# Altium schematic sheet Coverpage.SchDoc: =GlobalProjectName
size A3; DrawnBy: Mogens Groth Nicolaisen; DocumentNumber: 1; SheetNumber: 1; SheetTotal: 7
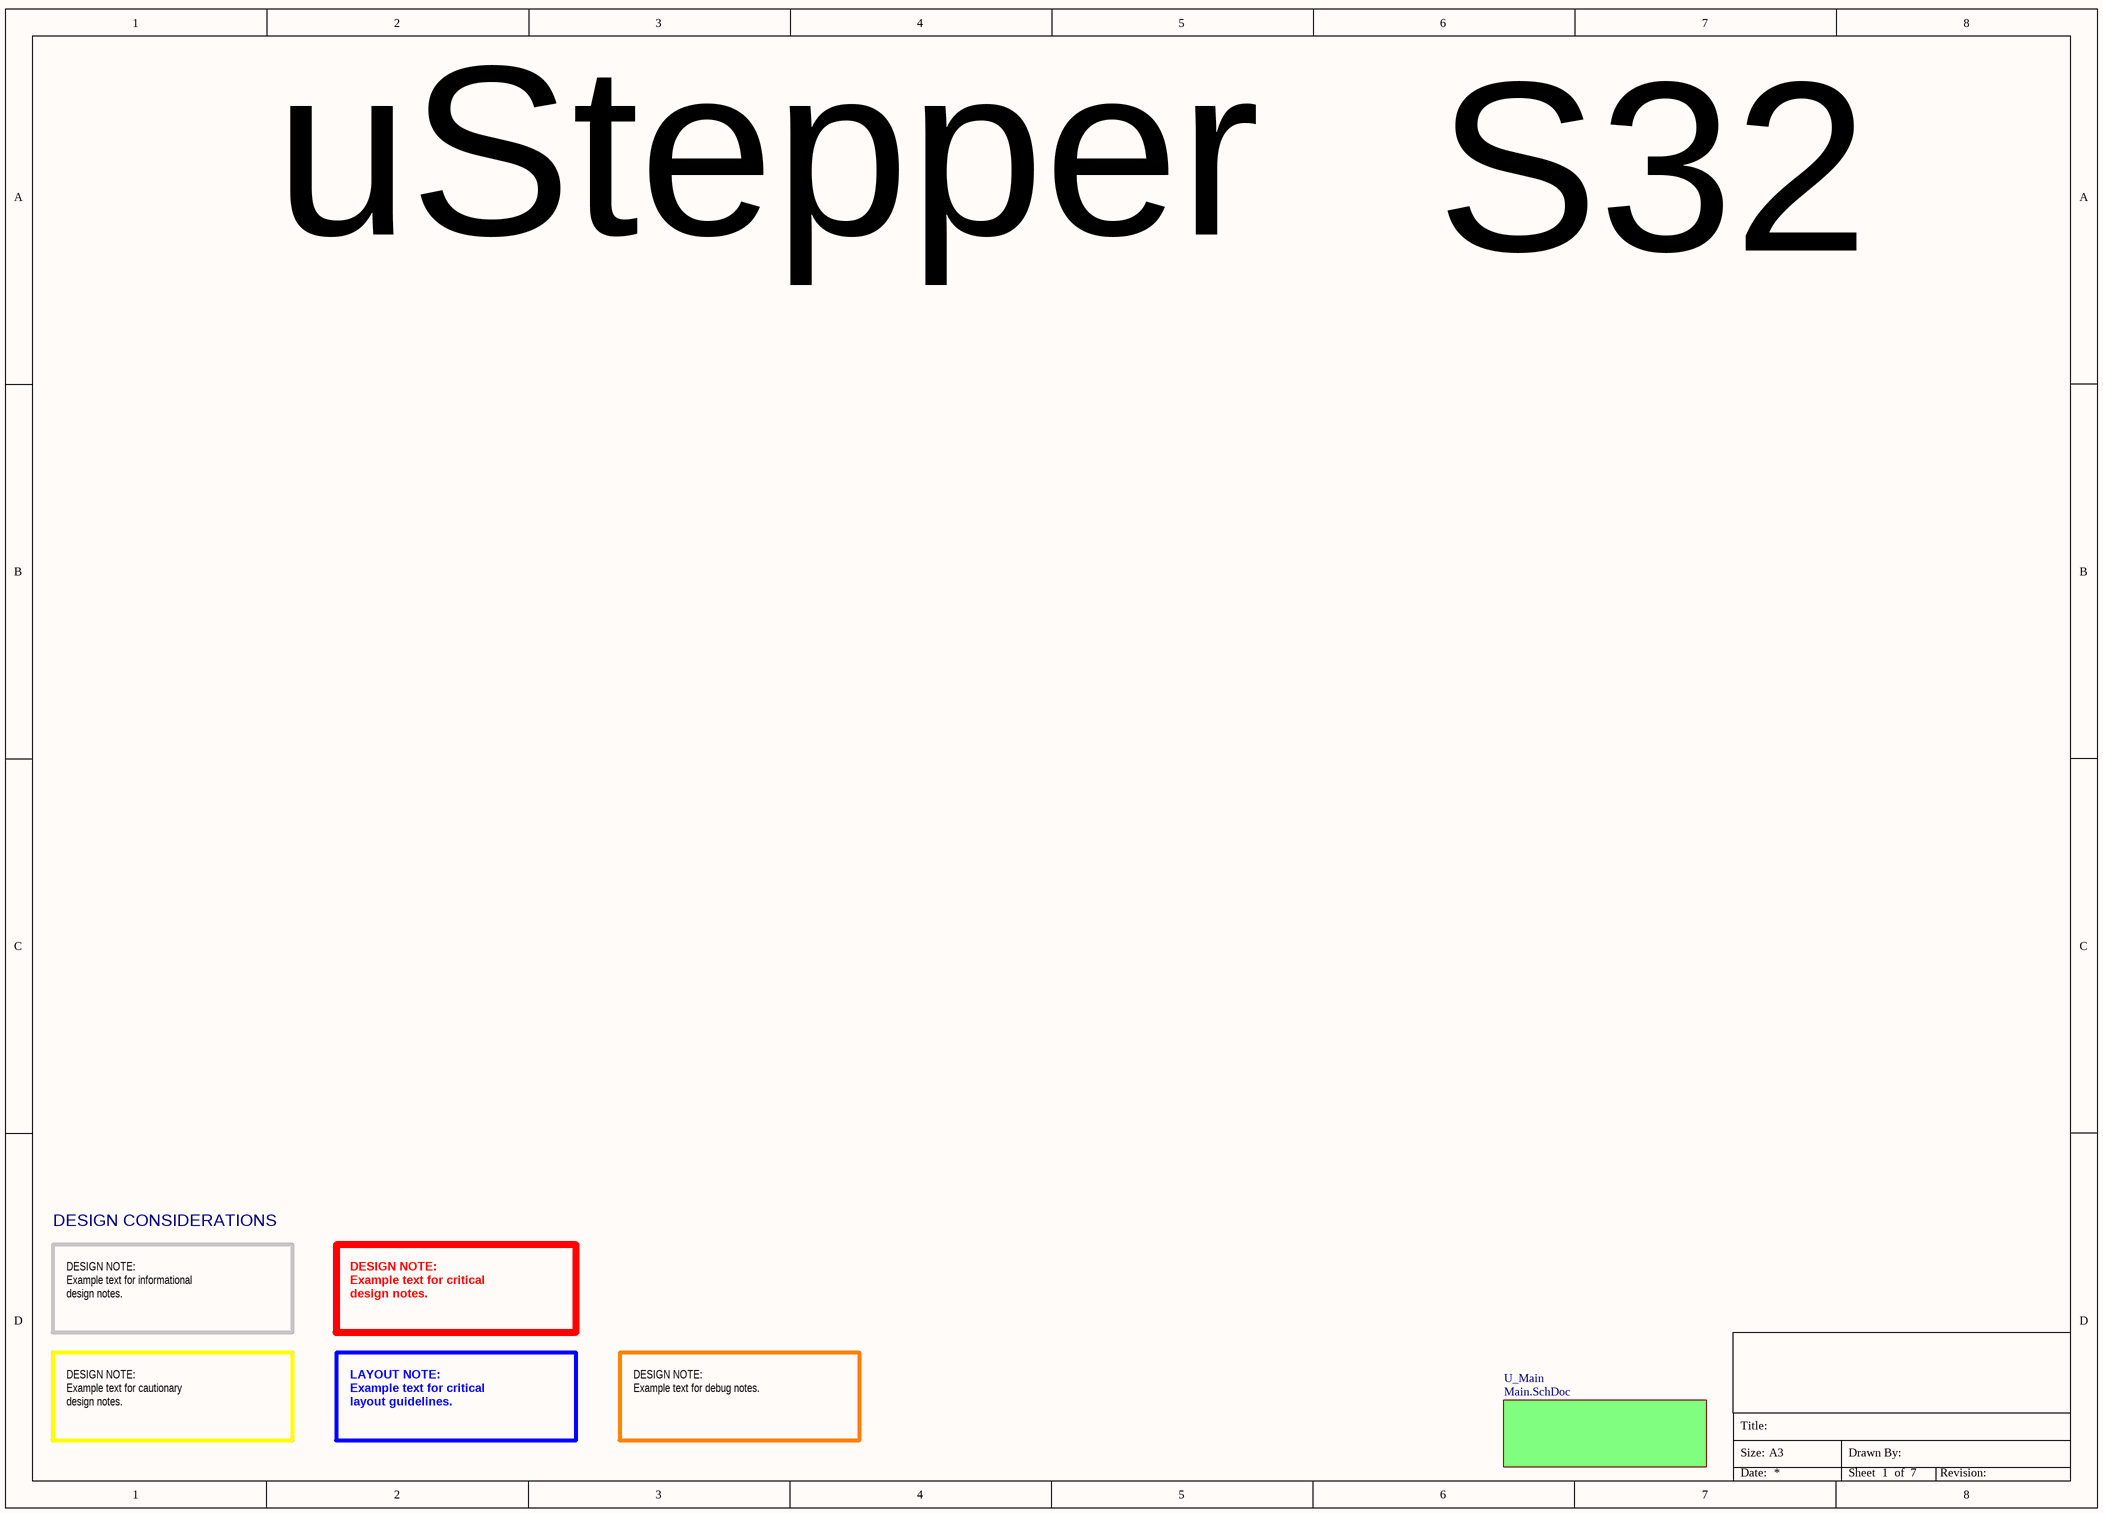
[diagram p0: Coverpage.SchDoc]

## Sub-sheets
U_Main = Main.SchDoc: no entries

## Notes on the sheet
- uStepper
- S32
- DESIGN CONSIDERATIONS
- DESIGN NOTE:
  Example text for informational
  design notes.
- DESIGN NOTE:
  Example text for critical
  design notes.
- DESIGN NOTE:
  Example text for cautionary
  design notes.
- LAYOUT NOTE:
  Example text for critical
  layout guidelines.
- DESIGN NOTE:
  Example text for debug notes.
- Title:
- Size:
- A3
- Drawn By:
- Date:
- Sheet
- of
- Revision: